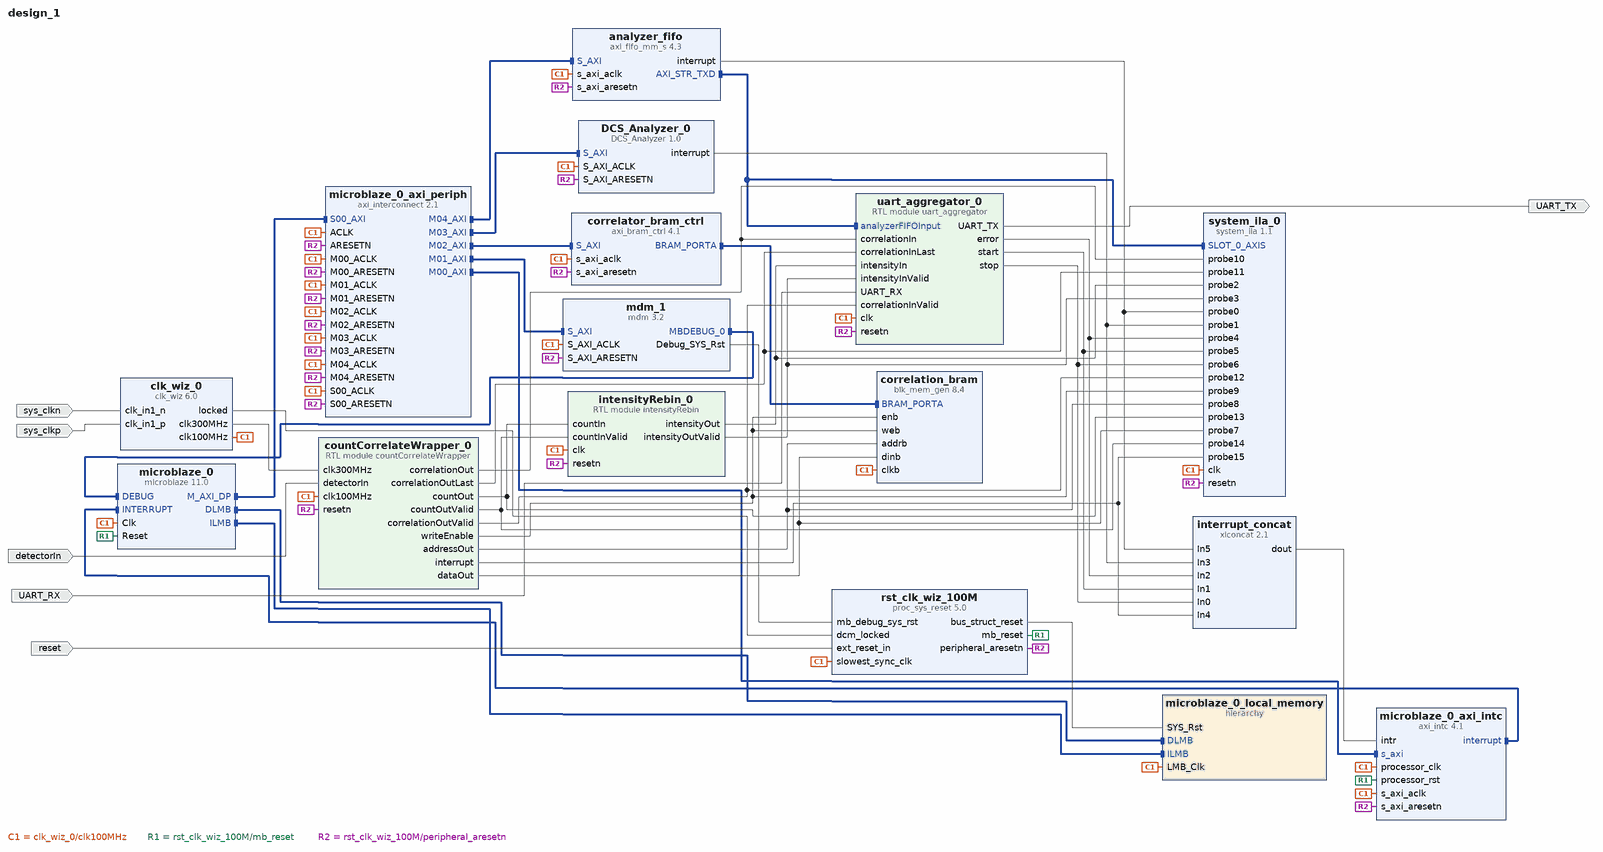
[diagram p0: block diagram of the top level]
# Vivado block design design_1, xc7a75tfgg484-1, Vivado 2023.1
create_bd_design design_1

create_bd_port -dir I -type clk sys_clkp
set_property -dict {CONFIG.FREQ_HZ 200000000 CONFIG.PHASE 0.0} [get_bd_ports sys_clkp]
create_bd_port -dir I -type rst reset
set_property -dict {CONFIG.POLARITY ACTIVE_LOW} [get_bd_ports reset]
create_bd_port -dir I detectorIn
create_bd_port -dir I UART_RX
create_bd_port -dir O UART_TX
create_bd_port -dir I -type clk sys_clkn
set_property -dict {CONFIG.FREQ_HZ 200000000} [get_bd_ports sys_clkn]

create_bd_cell -type hier microblaze_0_local_memory
create_bd_cell -type ip -vlnv xilinx.com:user:DCS_Analyzer:1.0 DCS_Analyzer_0
set_property -dict {CONFIG.correlation_length 64} [get_bd_cells DCS_Analyzer_0]
create_bd_cell -type ip -vlnv xilinx.com:ip:axi_bram_ctrl:4.1 correlator_bram_ctrl
set_property -dict {CONFIG.RD_CMD_OPTIMIZATION 1 CONFIG.SINGLE_PORT_BRAM 1} [get_bd_cells correlator_bram_ctrl]
create_bd_cell -type ip -vlnv xilinx.com:ip:blk_mem_gen:8.4 correlation_bram
set_property -dict [list \
  CONFIG.Assume_Synchronous_Clk true \
  CONFIG.Enable_B Use_ENB_Pin \
  CONFIG.Memory_Type True_Dual_Port_RAM \
  CONFIG.Port_B_Clock 100 \
  CONFIG.Port_B_Enable_Rate 100 \
  CONFIG.Port_B_Write_Rate 50 \
  CONFIG.Use_RSTB_Pin true \
] [get_bd_cells correlation_bram]
create_bd_cell -type ip -vlnv xilinx.com:ip:axi_fifo_mm_s:4.3 analyzer_fifo
set_property -dict {CONFIG.C_USE_RX_DATA 0 CONFIG.C_USE_TX_CTRL 0 CONFIG.C_USE_TX_CUT_THROUGH 0} [get_bd_cells analyzer_fifo]
create_bd_cell -type ip -vlnv xilinx.com:ip:clk_wiz:6.0 clk_wiz_0
set_property -dict [list \
  CONFIG.CLKIN1_JITTER_PS 50.0 \
  CONFIG.CLKIN2_JITTER_PS 56.239999999999995 \
  CONFIG.CLKOUT1_DRIVES BUFG \
  CONFIG.CLKOUT1_JITTER 136.686 \
  CONFIG.CLKOUT1_PHASE_ERROR 105.461 \
  CONFIG.CLKOUT2_DRIVES BUFG \
  CONFIG.CLKOUT2_JITTER 110.944 \
  CONFIG.CLKOUT2_PHASE_ERROR 105.461 \
  CONFIG.CLKOUT2_REQUESTED_OUT_FREQ 300.000 \
  CONFIG.CLKOUT2_USED true \
  CONFIG.CLKOUT3_DRIVES BUFG \
  CONFIG.CLKOUT4_DRIVES BUFG \
  CONFIG.CLKOUT5_DRIVES BUFG \
  CONFIG.CLKOUT6_DRIVES BUFG \
  CONFIG.CLKOUT7_DRIVES BUFG \
  CONFIG.CLK_IN1_BOARD_INTERFACE Custom \
  CONFIG.CLK_IN2_BOARD_INTERFACE Custom \
  CONFIG.CLK_OUT1_PORT clk100MHz \
  CONFIG.CLK_OUT2_PORT clk300MHz \
  CONFIG.MMCM_BANDWIDTH OPTIMIZED \
  CONFIG.MMCM_CLKFBOUT_MULT_F 9 \
  CONFIG.MMCM_CLKIN1_PERIOD 5.000 \
  CONFIG.MMCM_CLKIN2_PERIOD 10.0 \
  CONFIG.MMCM_CLKOUT0_DIVIDE_F 9 \
  CONFIG.MMCM_CLKOUT1_DIVIDE 3 \
  CONFIG.MMCM_COMPENSATION ZHOLD \
  CONFIG.MMCM_DIVCLK_DIVIDE 2 \
  CONFIG.NUM_OUT_CLKS 2 \
  CONFIG.PLL_CLKIN_PERIOD 5.000 \
  CONFIG.PRIMITIVE PLL \
  CONFIG.PRIM_IN_FREQ 200.000 \
  CONFIG.PRIM_SOURCE Differential_clock_capable_pin \
  CONFIG.RESET_BOARD_INTERFACE Custom \
  CONFIG.RESET_PORT reset \
  CONFIG.RESET_TYPE ACTIVE_HIGH \
  CONFIG.SECONDARY_SOURCE Single_ended_clock_capable_pin \
  CONFIG.USE_BOARD_FLOW true \
  CONFIG.USE_INCLK_SWITCHOVER false \
  CONFIG.USE_RESET false \
] [get_bd_cells clk_wiz_0]
create_bd_cell -type module -reference intensityRebin intensityRebin_0
create_bd_cell -type ip -vlnv xilinx.com:ip:mdm:3.2 mdm_1
set_property -dict {CONFIG.C_ADDR_SIZE 32 CONFIG.C_M_AXI_ADDR_WIDTH 32 CONFIG.C_USE_UART 1} [get_bd_cells mdm_1]
create_bd_cell -type ip -vlnv xilinx.com:ip:microblaze:11.0 microblaze_0
set_property -dict [list \
  CONFIG.C_ADDR_TAG_BITS 0 \
  CONFIG.C_AREA_OPTIMIZED 0 \
  CONFIG.C_DATA_SIZE 32 \
  CONFIG.C_DCACHE_ADDR_TAG 0 \
  CONFIG.C_DEBUG_ENABLED 1 \
  CONFIG.C_D_AXI 1 \
  CONFIG.C_D_LMB 1 \
  CONFIG.C_FSL_LINKS 0 \
  CONFIG.C_I_LMB 1 \
  CONFIG.C_USE_BARREL 1 \
  CONFIG.C_USE_BRANCH_TARGET_CACHE 1 \
  CONFIG.C_USE_DIV 0 \
  CONFIG.C_USE_FPU 1 \
  CONFIG.C_USE_HW_MUL 1 \
  CONFIG.C_USE_MSR_INSTR 1 \
  CONFIG.C_USE_PCMP_INSTR 0 \
  CONFIG.C_USE_REORDER_INSTR 0 \
  CONFIG.C_USE_STACK_PROTECTION 0 \
  CONFIG.G_TEMPLATE_LIST 8 \
] [get_bd_cells microblaze_0]
create_bd_cell -type ip -vlnv xilinx.com:ip:axi_intc:4.1 microblaze_0_axi_intc
set_property -dict {CONFIG.C_HAS_FAST 1 CONFIG.C_IRQ_IS_LEVEL 0} [get_bd_cells microblaze_0_axi_intc]
create_bd_cell -type ip -vlnv xilinx.com:ip:axi_interconnect:2.1 microblaze_0_axi_periph
set_property -dict {CONFIG.NUM_MI 5} [get_bd_cells microblaze_0_axi_periph]
create_bd_cell -type ip -vlnv xilinx.com:ip:xlconcat:2.1 interrupt_concat
set_property -dict {CONFIG.NUM_PORTS 6 CONFIG.dout_width 6} [get_bd_cells interrupt_concat]
create_bd_cell -type ip -vlnv xilinx.com:ip:proc_sys_reset:5.0 rst_clk_wiz_100M
create_bd_cell -type ip -vlnv xilinx.com:ip:system_ila:1.1 system_ila_0
set_property -dict [list \
  CONFIG.C_DATA_DEPTH 4096 \
  CONFIG.C_MON_TYPE MIX \
  CONFIG.C_NUM_MONITOR_SLOTS 1 \
  CONFIG.C_NUM_OF_PROBES 16 \
  CONFIG.C_PROBE0_TYPE 0 \
  CONFIG.C_PROBE10_TYPE 0 \
  CONFIG.C_PROBE11_TYPE 0 \
  CONFIG.C_PROBE12_TYPE 0 \
  CONFIG.C_PROBE13_TYPE 0 \
  CONFIG.C_PROBE14_TYPE 0 \
  CONFIG.C_PROBE15_TYPE 0 \
  CONFIG.C_PROBE1_TYPE 0 \
  CONFIG.C_PROBE2_TYPE 0 \
  CONFIG.C_PROBE3_TYPE 0 \
  CONFIG.C_PROBE4_TYPE 0 \
  CONFIG.C_PROBE5_TYPE 0 \
  CONFIG.C_PROBE6_TYPE 0 \
  CONFIG.C_PROBE8_TYPE 0 \
  CONFIG.C_PROBE9_TYPE 0 \
  CONFIG.C_SLOT_0_APC_EN 0 \
  CONFIG.C_SLOT_0_AXI_DATA_SEL 1 \
  CONFIG.C_SLOT_0_AXI_TRIG_SEL 1 \
  CONFIG.C_SLOT_0_INTF_TYPE xilinx.com:interface:axis_rtl:1.0 \
] [get_bd_cells system_ila_0]
create_bd_cell -type module -reference countCorrelateWrapper countCorrelateWrapper_0
create_bd_cell -type module -reference uart_aggregator uart_aggregator_0
set_property -dict {CONFIG.correlationLength 64} [get_bd_cells uart_aggregator_0]

# ---- hierarchy /microblaze_0_local_memory ----
current_bd_instance /microblaze_0_local_memory
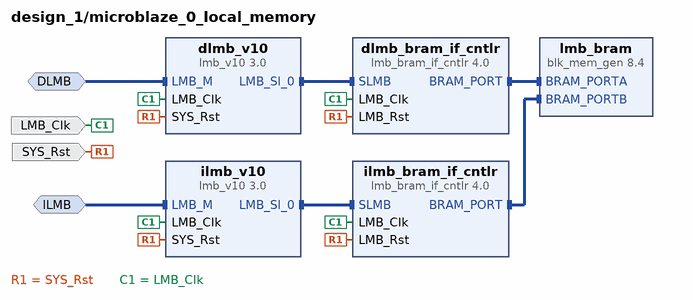
[diagram p1: block diagram inside /microblaze_0_local_memory]
create_bd_intf_pin -mode MirroredMaster -vlnv xilinx.com:interface:lmb_rtl:1.0 DLMB
create_bd_intf_pin -mode MirroredMaster -vlnv xilinx.com:interface:lmb_rtl:1.0 ILMB
create_bd_pin -dir I -type clk LMB_Clk
create_bd_pin -dir I -type rst SYS_Rst

create_bd_cell -type ip -vlnv xilinx.com:ip:lmb_bram_if_cntlr:4.0 dlmb_bram_if_cntlr
set_property -dict {CONFIG.C_ECC 0} [get_bd_cells dlmb_bram_if_cntlr]
create_bd_cell -type ip -vlnv xilinx.com:ip:lmb_v10:3.0 dlmb_v10
create_bd_cell -type ip -vlnv xilinx.com:ip:lmb_bram_if_cntlr:4.0 ilmb_bram_if_cntlr
set_property -dict {CONFIG.C_ECC 0} [get_bd_cells ilmb_bram_if_cntlr]
create_bd_cell -type ip -vlnv xilinx.com:ip:lmb_v10:3.0 ilmb_v10
create_bd_cell -type ip -vlnv xilinx.com:ip:blk_mem_gen:8.4 lmb_bram
set_property -dict [list \
  CONFIG.Enable_B Use_ENB_Pin \
  CONFIG.Memory_Type True_Dual_Port_RAM \
  CONFIG.Port_B_Clock 100 \
  CONFIG.Port_B_Enable_Rate 100 \
  CONFIG.Port_B_Write_Rate 50 \
  CONFIG.Use_RSTB_Pin true \
  CONFIG.use_bram_block BRAM_Controller \
] [get_bd_cells lmb_bram]

# ---- connections ----

current_bd_instance /microblaze_0_local_memory
connect_bd_intf_net -intf_net microblaze_0_dlmb [get_bd_intf_pins DLMB] [get_bd_intf_pins dlmb_v10/LMB_M]
connect_bd_intf_net -intf_net microblaze_0_dlmb_bus [get_bd_intf_pins dlmb_v10/LMB_Sl_0] [get_bd_intf_pins dlmb_bram_if_cntlr/SLMB]
connect_bd_intf_net -intf_net microblaze_0_dlmb_cntlr [get_bd_intf_pins dlmb_bram_if_cntlr/BRAM_PORT] [get_bd_intf_pins lmb_bram/BRAM_PORTA]
connect_bd_intf_net -intf_net microblaze_0_ilmb [get_bd_intf_pins ILMB] [get_bd_intf_pins ilmb_v10/LMB_M]
connect_bd_intf_net -intf_net microblaze_0_ilmb_bus [get_bd_intf_pins ilmb_v10/LMB_Sl_0] [get_bd_intf_pins ilmb_bram_if_cntlr/SLMB]
connect_bd_intf_net -intf_net microblaze_0_ilmb_cntlr [get_bd_intf_pins ilmb_bram_if_cntlr/BRAM_PORT] [get_bd_intf_pins lmb_bram/BRAM_PORTB]
connect_bd_net [get_bd_pins SYS_Rst] \
  [get_bd_pins dlmb_bram_if_cntlr/LMB_Rst] [get_bd_pins dlmb_v10/SYS_Rst] [get_bd_pins ilmb_bram_if_cntlr/LMB_Rst] \
  [get_bd_pins ilmb_v10/SYS_Rst]
connect_bd_net -net microblaze_0_Clk [get_bd_pins LMB_Clk] \
  [get_bd_pins dlmb_bram_if_cntlr/LMB_Clk] [get_bd_pins dlmb_v10/LMB_Clk] [get_bd_pins ilmb_bram_if_cntlr/LMB_Clk] \
  [get_bd_pins ilmb_v10/LMB_Clk]
set_property HDL_ATTRIBUTE.BMM_INFO_ADDRESS_SPACE {byte  0x00000000 32 > design_1 microblaze_0_local_memory/lmb_bram} [get_bd_cells dlmb_bram_if_cntlr]
set_property HDL_ATTRIBUTE.KEEP_HIERARCHY yes [get_bd_cells dlmb_bram_if_cntlr]

current_bd_instance /
connect_bd_intf_net -intf_net analyzer_fifo_AXI_STR_TXD [get_bd_intf_pins analyzer_fifo/AXI_STR_TXD] [get_bd_intf_pins uart_aggregator_0/analyzerFIFOInput]
connect_bd_intf_net [get_bd_intf_pins analyzer_fifo/AXI_STR_TXD] [get_bd_intf_pins system_ila_0/SLOT_0_AXIS]
connect_bd_intf_net -intf_net axi_bram_ctrl_0_BRAM_PORTA [get_bd_intf_pins correlation_bram/BRAM_PORTA] [get_bd_intf_pins correlator_bram_ctrl/BRAM_PORTA]
connect_bd_intf_net -intf_net microblaze_0_axi_dp [get_bd_intf_pins microblaze_0_axi_periph/S00_AXI] [get_bd_intf_pins microblaze_0/M_AXI_DP]
connect_bd_intf_net [get_bd_intf_pins microblaze_0_axi_periph/M01_AXI] [get_bd_intf_pins mdm_1/S_AXI]
connect_bd_intf_net [get_bd_intf_pins microblaze_0_axi_periph/M02_AXI] [get_bd_intf_pins correlator_bram_ctrl/S_AXI]
connect_bd_intf_net [get_bd_intf_pins microblaze_0_axi_periph/M03_AXI] [get_bd_intf_pins DCS_Analyzer_0/S_AXI]
connect_bd_intf_net [get_bd_intf_pins microblaze_0_axi_periph/M04_AXI] [get_bd_intf_pins analyzer_fifo/S_AXI]
connect_bd_intf_net [get_bd_intf_pins mdm_1/MBDEBUG_0] [get_bd_intf_pins microblaze_0/DEBUG]
connect_bd_intf_net [get_bd_intf_pins microblaze_0/DLMB] [get_bd_intf_pins microblaze_0_local_memory/DLMB]
connect_bd_intf_net [get_bd_intf_pins microblaze_0/ILMB] [get_bd_intf_pins microblaze_0_local_memory/ILMB]
connect_bd_intf_net -intf_net microblaze_0_intc_axi [get_bd_intf_pins microblaze_0_axi_periph/M00_AXI] [get_bd_intf_pins microblaze_0_axi_intc/s_axi]
connect_bd_intf_net [get_bd_intf_pins microblaze_0_axi_intc/interrupt] [get_bd_intf_pins microblaze_0/INTERRUPT]
connect_bd_net -net DCS_Analyzer_0_interrupt [get_bd_pins DCS_Analyzer_0/interrupt] \
  [get_bd_pins interrupt_concat/In3] [get_bd_pins system_ila_0/probe1]
connect_bd_net -net UART_RX_0_1 [get_bd_ports UART_RX] [get_bd_pins uart_aggregator_0/UART_RX]
connect_bd_net -net analyzer_fifo_interrupt [get_bd_pins analyzer_fifo/interrupt] [get_bd_pins interrupt_concat/In5] [get_bd_pins system_ila_0/probe0]
connect_bd_net -net clk100MHz [get_bd_pins clk_wiz_0/clk100MHz] \
  [get_bd_pins microblaze_0_local_memory/LMB_Clk] [get_bd_pins DCS_Analyzer_0/S_AXI_ACLK] \
  [get_bd_pins correlator_bram_ctrl/s_axi_aclk] [get_bd_pins correlation_bram/clkb] [get_bd_pins analyzer_fifo/s_axi_aclk] \
  [get_bd_pins intensityRebin_0/clk] [get_bd_pins mdm_1/S_AXI_ACLK] [get_bd_pins microblaze_0/Clk] \
  [get_bd_pins microblaze_0_axi_intc/s_axi_aclk] [get_bd_pins microblaze_0_axi_intc/processor_clk] \
  [get_bd_pins microblaze_0_axi_periph/ACLK] [get_bd_pins microblaze_0_axi_periph/S00_ACLK] \
  [get_bd_pins microblaze_0_axi_periph/M00_ACLK] [get_bd_pins microblaze_0_axi_periph/M01_ACLK] \
  [get_bd_pins microblaze_0_axi_periph/M02_ACLK] [get_bd_pins microblaze_0_axi_periph/M03_ACLK] \
  [get_bd_pins microblaze_0_axi_periph/M04_ACLK] [get_bd_pins rst_clk_wiz_100M/slowest_sync_clk] \
  [get_bd_pins system_ila_0/clk] [get_bd_pins countCorrelateWrapper_0/clk100MHz] [get_bd_pins uart_aggregator_0/clk]
connect_bd_net -net clk300MHz [get_bd_pins clk_wiz_0/clk300MHz] [get_bd_pins countCorrelateWrapper_0/clk300MHz]
connect_bd_net [get_bd_pins clk_wiz_0/locked] [get_bd_pins rst_clk_wiz_100M/dcm_locked]
connect_bd_net -net correlator_write_con_0_writeEnable [get_bd_pins countCorrelateWrapper_0/writeEnable] \
  [get_bd_pins correlation_bram/enb] [get_bd_pins correlation_bram/web] [get_bd_pins system_ila_0/probe9]
connect_bd_net -net countCorrelateWrapper_0_addressOut [get_bd_pins countCorrelateWrapper_0/addressOut] \
  [get_bd_pins correlation_bram/addrb] [get_bd_pins system_ila_0/probe8]
connect_bd_net -net countCorrelateWrapper_0_correlationOut [get_bd_pins countCorrelateWrapper_0/correlationOut] \
  [get_bd_pins system_ila_0/probe10] [get_bd_pins uart_aggregator_0/correlationIn]
connect_bd_net -net countCorrelateWrapper_0_correlationOutLast [get_bd_pins countCorrelateWrapper_0/correlationOutLast] \
  [get_bd_pins system_ila_0/probe11] [get_bd_pins uart_aggregator_0/correlationInLast]
connect_bd_net -net countCorrelateWrapper_0_correlationOutValid [get_bd_pins countCorrelateWrapper_0/correlationOutValid] \
  [get_bd_pins system_ila_0/probe12] [get_bd_pins uart_aggregator_0/correlationInValid]
connect_bd_net -net countCorrelateWrapper_0_countOut [get_bd_pins countCorrelateWrapper_0/countOut] \
  [get_bd_pins intensityRebin_0/countIn] [get_bd_pins system_ila_0/probe13]
connect_bd_net -net countCorrelateWrapper_0_countOutValid [get_bd_pins countCorrelateWrapper_0/countOutValid] \
  [get_bd_pins intensityRebin_0/countInValid] [get_bd_pins system_ila_0/probe14]
connect_bd_net -net countCorrelateWrapper_0_dataOut [get_bd_pins countCorrelateWrapper_0/dataOut] \
  [get_bd_pins correlation_bram/dinb] [get_bd_pins system_ila_0/probe7]
connect_bd_net -net countCorrelateWrapper_0_interrupt [get_bd_pins countCorrelateWrapper_0/interrupt] \
  [get_bd_pins interrupt_concat/In4] [get_bd_pins system_ila_0/probe15]
connect_bd_net -net detectorIn_0_1 [get_bd_ports detectorIn] [get_bd_pins countCorrelateWrapper_0/detectorIn]
connect_bd_net -net intensityRebin_0_intensityOut [get_bd_pins intensityRebin_0/intensityOut] \
  [get_bd_pins system_ila_0/probe2] [get_bd_pins uart_aggregator_0/intensityIn]
connect_bd_net -net intensityRebin_0_intensityOutValid [get_bd_pins intensityRebin_0/intensityOutValid] \
  [get_bd_pins system_ila_0/probe3] [get_bd_pins uart_aggregator_0/intensityInValid]
connect_bd_net [get_bd_pins mdm_1/Debug_SYS_Rst] [get_bd_pins rst_clk_wiz_100M/mb_debug_sys_rst]
connect_bd_net -net microblaze_0_intr [get_bd_pins interrupt_concat/dout] [get_bd_pins microblaze_0_axi_intc/intr]
connect_bd_net [get_bd_ports reset] [get_bd_pins rst_clk_wiz_100M/ext_reset_in]
connect_bd_net [get_bd_pins rst_clk_wiz_100M/bus_struct_reset] [get_bd_pins microblaze_0_local_memory/SYS_Rst]
connect_bd_net [get_bd_pins rst_clk_wiz_100M/mb_reset] [get_bd_pins microblaze_0/Reset] [get_bd_pins microblaze_0_axi_intc/processor_rst]
connect_bd_net [get_bd_pins rst_clk_wiz_100M/peripheral_aresetn] \
  [get_bd_pins DCS_Analyzer_0/S_AXI_ARESETN] [get_bd_pins correlator_bram_ctrl/s_axi_aresetn] \
  [get_bd_pins analyzer_fifo/s_axi_aresetn] [get_bd_pins intensityRebin_0/resetn] [get_bd_pins mdm_1/S_AXI_ARESETN] \
  [get_bd_pins microblaze_0_axi_intc/s_axi_aresetn] [get_bd_pins microblaze_0_axi_periph/ARESETN] \
  [get_bd_pins microblaze_0_axi_periph/S00_ARESETN] [get_bd_pins microblaze_0_axi_periph/M00_ARESETN] \
  [get_bd_pins microblaze_0_axi_periph/M01_ARESETN] [get_bd_pins microblaze_0_axi_periph/M02_ARESETN] \
  [get_bd_pins microblaze_0_axi_periph/M03_ARESETN] [get_bd_pins microblaze_0_axi_periph/M04_ARESETN] \
  [get_bd_pins system_ila_0/resetn] [get_bd_pins countCorrelateWrapper_0/resetn] [get_bd_pins uart_aggregator_0/resetn]
connect_bd_net [get_bd_ports sys_clkn] [get_bd_pins clk_wiz_0/clk_in1_n]
connect_bd_net [get_bd_ports sys_clkp] [get_bd_pins clk_wiz_0/clk_in1_p]
connect_bd_net [get_bd_pins uart_aggregator_0/UART_TX] [get_bd_ports UART_TX]
connect_bd_net -net uart_aggregator_0_error [get_bd_pins uart_aggregator_0/error] [get_bd_pins interrupt_concat/In2] [get_bd_pins system_ila_0/probe4]
connect_bd_net -net uart_aggregator_0_start [get_bd_pins uart_aggregator_0/start] [get_bd_pins interrupt_concat/In1] [get_bd_pins system_ila_0/probe5]
connect_bd_net -net uart_aggregator_0_stop [get_bd_pins uart_aggregator_0/stop] [get_bd_pins interrupt_concat/In0] [get_bd_pins system_ila_0/probe6]
set_property HDL_ATTRIBUTE.BMM_INFO_ADDRESS_SPACE {byte  0xC0000000 32 > design_1 correlation_bram} [get_bd_cells correlator_bram_ctrl]
set_property HDL_ATTRIBUTE.KEEP_HIERARCHY yes [get_bd_cells correlator_bram_ctrl]
set_property HDL_ATTRIBUTE.BMM_INFO_PROCESSOR {microblaze-le > design_1 microblaze_0_local_memory/dlmb_bram_if_cntlr design_1 correlator_bram_ctrl} [get_bd_cells microblaze_0]
set_property HDL_ATTRIBUTE.KEEP_HIERARCHY yes [get_bd_cells microblaze_0]
set_property HDL_ATTRIBUTE.DEBUG true [get_bd_intf_nets analyzer_fifo_AXI_STR_TXD]
set_property HDL_ATTRIBUTE.MARK_DEBUG true [get_bd_intf_nets analyzer_fifo_AXI_STR_TXD]
set_property HDL_ATTRIBUTE.DEBUG true [get_bd_nets DCS_Analyzer_0_interrupt]
set_property HDL_ATTRIBUTE.MARK_DEBUG true [get_bd_nets DCS_Analyzer_0_interrupt]
set_property HDL_ATTRIBUTE.DEBUG true [get_bd_nets analyzer_fifo_interrupt]
set_property HDL_ATTRIBUTE.MARK_DEBUG true [get_bd_nets analyzer_fifo_interrupt]
set_property HDL_ATTRIBUTE.DEBUG true [get_bd_nets correlator_write_con_0_writeEnable]
set_property HDL_ATTRIBUTE.MARK_DEBUG true [get_bd_nets correlator_write_con_0_writeEnable]
set_property HDL_ATTRIBUTE.DEBUG true [get_bd_nets countCorrelateWrapper_0_addressOut]
set_property HDL_ATTRIBUTE.MARK_DEBUG true [get_bd_nets countCorrelateWrapper_0_addressOut]
set_property HDL_ATTRIBUTE.DEBUG true [get_bd_nets countCorrelateWrapper_0_correlationOut]
set_property HDL_ATTRIBUTE.MARK_DEBUG true [get_bd_nets countCorrelateWrapper_0_correlationOut]
set_property HDL_ATTRIBUTE.DEBUG true [get_bd_nets countCorrelateWrapper_0_correlationOutLast]
set_property HDL_ATTRIBUTE.MARK_DEBUG true [get_bd_nets countCorrelateWrapper_0_correlationOutLast]
set_property HDL_ATTRIBUTE.DEBUG true [get_bd_nets countCorrelateWrapper_0_correlationOutValid]
set_property HDL_ATTRIBUTE.MARK_DEBUG true [get_bd_nets countCorrelateWrapper_0_correlationOutValid]
set_property HDL_ATTRIBUTE.DEBUG true [get_bd_nets countCorrelateWrapper_0_countOut]
set_property HDL_ATTRIBUTE.MARK_DEBUG true [get_bd_nets countCorrelateWrapper_0_countOut]
set_property HDL_ATTRIBUTE.DEBUG true [get_bd_nets countCorrelateWrapper_0_countOutValid]
set_property HDL_ATTRIBUTE.MARK_DEBUG true [get_bd_nets countCorrelateWrapper_0_countOutValid]
set_property HDL_ATTRIBUTE.DEBUG true [get_bd_nets countCorrelateWrapper_0_dataOut]
set_property HDL_ATTRIBUTE.MARK_DEBUG true [get_bd_nets countCorrelateWrapper_0_dataOut]
set_property HDL_ATTRIBUTE.DEBUG true [get_bd_nets countCorrelateWrapper_0_interrupt]
set_property HDL_ATTRIBUTE.MARK_DEBUG true [get_bd_nets countCorrelateWrapper_0_interrupt]
set_property HDL_ATTRIBUTE.DEBUG true [get_bd_nets intensityRebin_0_intensityOut]
set_property HDL_ATTRIBUTE.MARK_DEBUG true [get_bd_nets intensityRebin_0_intensityOut]
set_property HDL_ATTRIBUTE.DEBUG true [get_bd_nets intensityRebin_0_intensityOutValid]
set_property HDL_ATTRIBUTE.MARK_DEBUG true [get_bd_nets intensityRebin_0_intensityOutValid]
set_property HDL_ATTRIBUTE.DEBUG true [get_bd_nets uart_aggregator_0_error]
set_property HDL_ATTRIBUTE.MARK_DEBUG true [get_bd_nets uart_aggregator_0_error]
set_property HDL_ATTRIBUTE.DEBUG true [get_bd_nets uart_aggregator_0_start]
set_property HDL_ATTRIBUTE.MARK_DEBUG true [get_bd_nets uart_aggregator_0_start]
set_property HDL_ATTRIBUTE.DEBUG true [get_bd_nets uart_aggregator_0_stop]
set_property HDL_ATTRIBUTE.MARK_DEBUG true [get_bd_nets uart_aggregator_0_stop]

# ---- address map ----
assign_bd_address -offset 0x00000000 -range 32K -target_address_space [get_bd_addr_spaces microblaze_0/Data] [get_bd_addr_segs microblaze_0_local_memory/dlmb_bram_if_cntlr/SLMB/Mem]
assign_bd_address -offset 0x41200000 -range 64K -target_address_space [get_bd_addr_spaces microblaze_0/Data] [get_bd_addr_segs microblaze_0_axi_intc/S_AXI/Reg]
assign_bd_address -offset 0x41400000 -range 4K -target_address_space [get_bd_addr_spaces microblaze_0/Data] [get_bd_addr_segs mdm_1/S_AXI/Reg]
assign_bd_address -offset 0x44A00000 -range 64K -target_address_space [get_bd_addr_spaces microblaze_0/Data] [get_bd_addr_segs analyzer_fifo/S_AXI/Mem0]
assign_bd_address -offset 0xC0000000 -range 4K -target_address_space [get_bd_addr_spaces microblaze_0/Data] [get_bd_addr_segs correlator_bram_ctrl/S_AXI/Mem0]
assign_bd_address -offset 0x00000000 -range 32K -target_address_space [get_bd_addr_spaces microblaze_0/Instruction] [get_bd_addr_segs microblaze_0_local_memory/ilmb_bram_if_cntlr/SLMB/Mem]

validate_bd_design
save_bd_design
